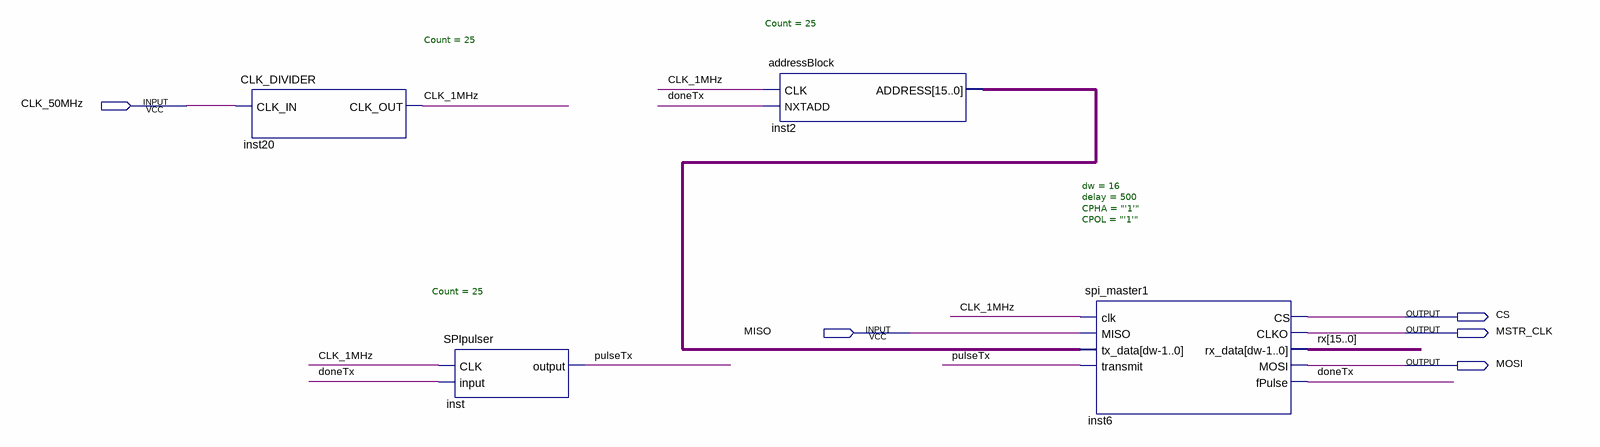
[diagram p0: schematic sheet]
// Quartus schematic SPIpulse.bdf as structural Verilog: 4 symbols, 5 pins
module SPIpulse (
  input  CLK_50MHz,
  input  MISO,
  output CS,
  output MSTR_CLK,
  output MOSI
);

  wire CLK_1MHz, doneTx, pulseTx;
  wire [15:0] inst2_address, rx;

  CLK_DIVIDER #(.Count(25)) inst20 (.CLK_IN(CLK_50MHz), .CLK_OUT(CLK_1MHz));
  SPIpulser #(.Count(25)) inst (.CLK(CLK_1MHz), .\input (doneTx), .\output (pulseTx));
  addressBlock #(.Count(25)) inst2 (.CLK(CLK_1MHz), .NXTADD(doneTx), .ADDRESS(inst2_address));
  spi_master1 #(.dw(16), .delay(500), .CPHA("'1'"), .CPOL("'1'")) inst6 (
    .clk(CLK_1MHz), .MISO(MISO), .tx_data(inst2_address), .transmit(pulseTx), .CS(CS), .CLKO(MSTR_CLK),
    .rx_data(rx), .MOSI(MOSI), .fPulse(doneTx));
endmodule
